# EasyEDA schematic SCH_popup_2025-01-21.json
TITLE: Sheet_1; REV: 1.0; Date: 2025-01-15; Sheet: 1/1; Drawn By: dumitrescu.florin94; Company: Your Company
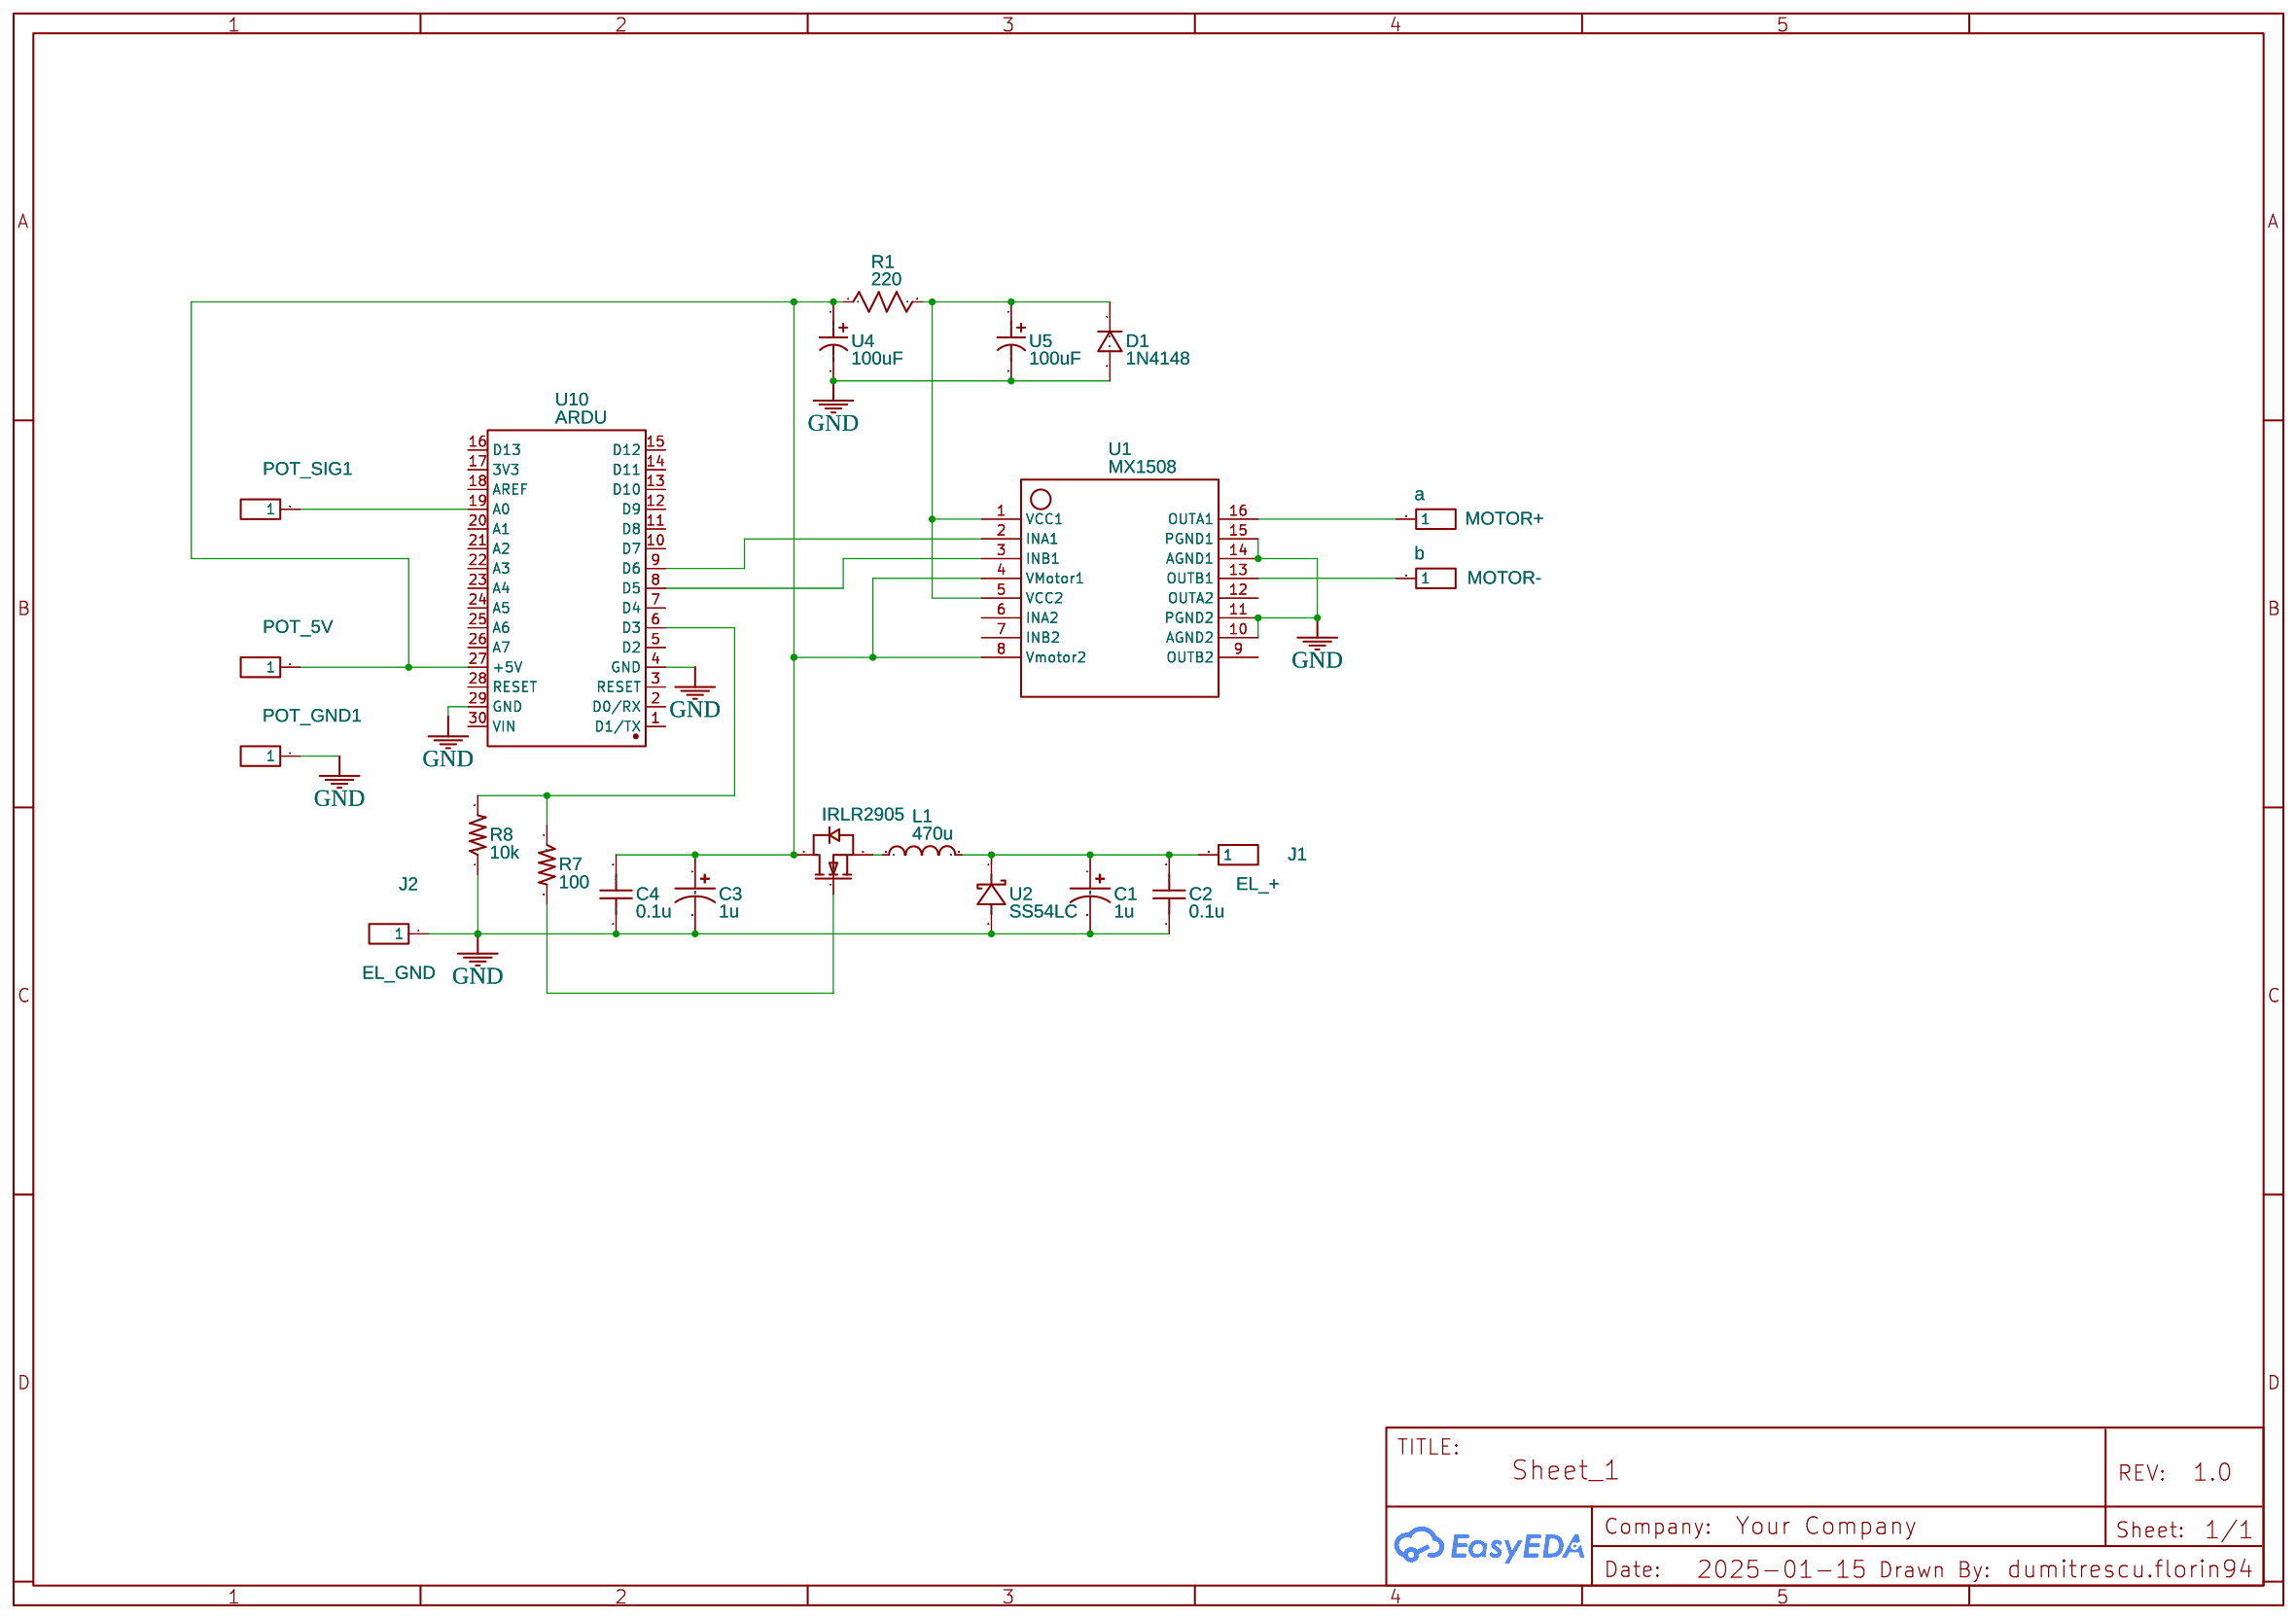
[diagram p0: schematic sheet]

## Parts
C1  1u  [CAP-D6.3×F2.5]
C2  0.1u  [C0805]
C3  1u  [CAP-D6.3-F2.5]
C4  0.1u  [C0805]
D1  1N4148  [DIO-SMD_L1.6-W0.8-CD4148WTP]
J1  EL_+  [HDR-M-2.54_1X1]
J2  EL_GND  [HDR-M-2.54_1X1]
L1  470u  [INDUCTOR_TOROIDAL_14X8]
MOTOR+  a  [HDR-M-2.54_1X1]
MOTOR-  b  [HDR-M-2.54_1X1]
POT_5V  MINUS  [HDR-M-2.54_1X1]
POT_GND1  MINUS  [HDR-M-2.54_1X1]
POT_SIG1  MINUS  [HDR-M-2.54_1X1]
R1  220  [0805]
R7  100  [0805]
R8  10k  [0805]
U1  MX1508  [MX1508]
U2  SS54LC  [DO-214AB_L6.9-W5.9-LS7.9-RD]
U4  100uF  [CAP-SMD_BD6.3-L6.6-W6.6-FD-2]
U5  100uF  [CAP-SMD_BD6.3-L6.6-W6.6-FD-2]
U7  IRLR2905  [TO-252-2_L6.6-W6.1-P4.57-LS9.9-BR-CW]
U10  ARDU  [COMM-TH_ARDUINO_NANO]

## Library data of the parts
C1 = CE_TH_D6.3×F2.5_US: Contributor: LCEDA_Lib
C2 C4 = C_0805_US: Contributor: LCEDA_Lib
C3 = CE_TH_D10.0×F5.0_US: Contributor: LCEDA_Lib
D1 = 1N4148: Supplier: LCSC; Supplier Part: C13769; Manufacturer: STMicroelectronics; Contributor: LCSC
J1 J2 MOTOR+ MOTOR- POT_5V POT_GND1 POT_SIG1 = HDR-M-2.54_1x1: Supplier Part: C81276; Supplier: LCSC; Contributor: LCEDA_Lib
L1 = L_AXIAL-0.6_US: Contributor: LCEDA_Lib
R1 = R_0201_US: Contributor: LCEDA_Lib
R7 R8 = RESISTORPTH-16W: Resistor; Contributor: SparkFun
U1 = MX1508: Contributor: egachiva12
U2 = SS54LC: Contributor: lcsc; Supplier: LCSC; Supplier Part: C3033290; Manufacturer: JUXING(钜兴); JLCPCB Part Class: Extended Part
U4 U5 = RX100UF35V90RV0103: Supplier: LCSC; Supplier Part: C3445236; Manufacturer: KNSCHA(科尼盛); Contributor: lcsc; JLCPCB Part Class: Extended Part
U7 = IRLR2905: Contributor: lcsc; Supplier: LCSC; Supplier Part: C5350899; Manufacturer: TECH PUBLIC(台舟); link: https://lcsc.com/eda_search?q=C5350899&%26type=1&ref=editor
U10 = ARDUINO_NANO: Contributor: lcsc; Supplier: LCSC; Supplier Part: C9900017879; Manufacturer: null; JLCPCB Part Class: Extended Part

## Nets
GND: C1.2 C2.1 C3.2 C4.1 D1.2 J2.1 POT_GND1.1 R8.1 U1.10(AGND2) U1.11(PGND2) U1.14(AGND1) U1.15(PGND1) U2.2(A) U4.2 U5.2 U10.4(GND) U10.29(GND)
Net-(C1-1): C1.1 C2.2 J1.1 L1.2 U2.1(K)
Net-(C3-1): C3.1 C4.2 POT_5V.1 R1.1 U1.4(VMotor1) U1.8(Vmotor2) U4.1 U7.2(D) U10.27(+5V)
Net-(D1-1): D1.1 R1.2 U1.1(VCC1) U1.5(VCC2) U5.1
Net-(L1-1): L1.1 U7.3(S)
Net-(MOTOR+-1): MOTOR+.1 U1.16(OUTA1)
Net-(MOTOR--1): MOTOR-.1 U1.13(OUTB1)
Net-(POT_SIG1-1): POT_SIG1.1 U10.19(A0)
Net-(R7-1): R7.1 R8.2 U10.6(D3)
Net-(R7-2): R7.2 U7.1(G)
Net-(U1-2): U1.2(INA1) U10.9(D6)
Net-(U1-3): U1.3(INB1) U10.8(D5)

Not connected (* = marked no-connect by the designer): U1 6(INA2) 7(INB2) 9(OUTB2) 12(OUTA2); U10 1(D1/TX) 2(D0/RX) 3(RESET) 5(D2) 7(D4) 10(D7) 11(D8) 12(D9) 13(D10) 14(D11) 15(D12) 16(D13) 17(3V3) 18(AREF) 20(A1) 21(A2) 22(A3) 23(A4) 24(A5) 25(A6) 26(A7) 28(RESET) 30(VIN)
